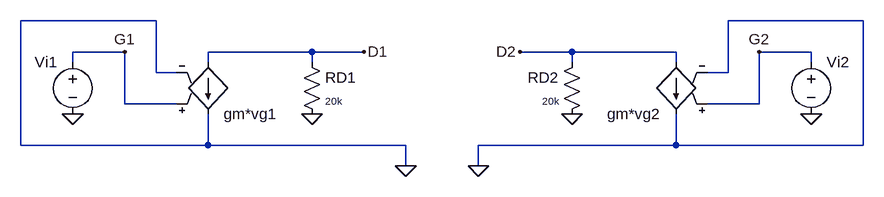
[diagram p0: schematic SmallSignalPiSingleEndedVID.asc]
SmallSignalPiSingleEndedVID.asc, the LTspice schematic file:
Version 4
SHEET 1 1268 680
WIRE 176 -400 -32 -400
WIRE 1264 -400 1056 -400
WIRE 128 -352 48 -352
WIRE 416 -352 256 -352
WIRE 496 -352 416 -352
WIRE 816 -352 736 -352
WIRE 976 -352 816 -352
WIRE 1184 -352 1104 -352
WIRE 48 -336 48 -352
WIRE 256 -336 256 -352
WIRE 416 -336 416 -352
WIRE 816 -336 816 -352
WIRE 976 -336 976 -352
WIRE 1184 -336 1184 -352
WIRE 176 -320 176 -400
WIRE 208 -320 176 -320
WIRE 1056 -320 1056 -400
WIRE 1056 -320 1024 -320
WIRE 128 -272 128 -352
WIRE 208 -272 128 -272
WIRE 1104 -272 1104 -352
WIRE 1104 -272 1024 -272
WIRE -32 -208 -32 -400
WIRE 256 -208 256 -256
WIRE 256 -208 -32 -208
WIRE 560 -208 256 -208
WIRE 976 -208 976 -256
WIRE 976 -208 672 -208
WIRE 1264 -208 1264 -400
WIRE 1264 -208 976 -208
WIRE 560 -176 560 -208
WIRE 672 -176 672 -208
FLAG 48 -256 0
FLAG 1184 -256 0
FLAG 416 -256 0
FLAG 128 -352 G1
FLAG 496 -352 D1
FLAG 736 -352 D2
FLAG 816 -256 0
FLAG 1104 -352 G2
FLAG 560 -176 0
FLAG 672 -176 0
SYMBOL res 400 -352 R0
WINDOW 3 36 76 Left 1
SYMATTR Value 20k
SYMATTR InstName RD1
SYMBOL voltage 1184 -352 R0
WINDOW 3 24 96 Invisible 2
SYMATTR InstName Vi2
SYMBOL voltage 48 -352 M0
WINDOW 3 24 96 Invisible 2
SYMATTR InstName Vi1
SYMBOL res 832 -352 M0
WINDOW 3 36 76 Left 1
SYMATTR Value 20k
SYMATTR InstName RD2
SYMBOL g 256 -240 M180
WINDOW 3 24 96 Invisible 2
SYMATTR InstName gm*vg1
SYMBOL g 976 -240 R180
WINDOW 3 24 96 Invisible 2
SYMATTR InstName gm*vg2

The netlist it stands for:
* SmallSignalPiSingleEndedVID.asc
RD1 D1 0 20k
Vi2 G2 0 V
Vi1 G1 0 V
RD2 D2 0 20k
gm*vg1 D1 0 G1 0 G
gm*vg2 D2 0 G2 0 G
.backanno
.end